# EasyEDA Pro project 调参板V2.eprj

# Schematic Schematic1
Create Date: 2024-02-26; Page Name: P1; Project Name: 调参板V2; Schematic Name: Schematic1; Update Date: 2024-02-26; Company: 嘉立创EDA; Page Size: A4; Version: V1.0
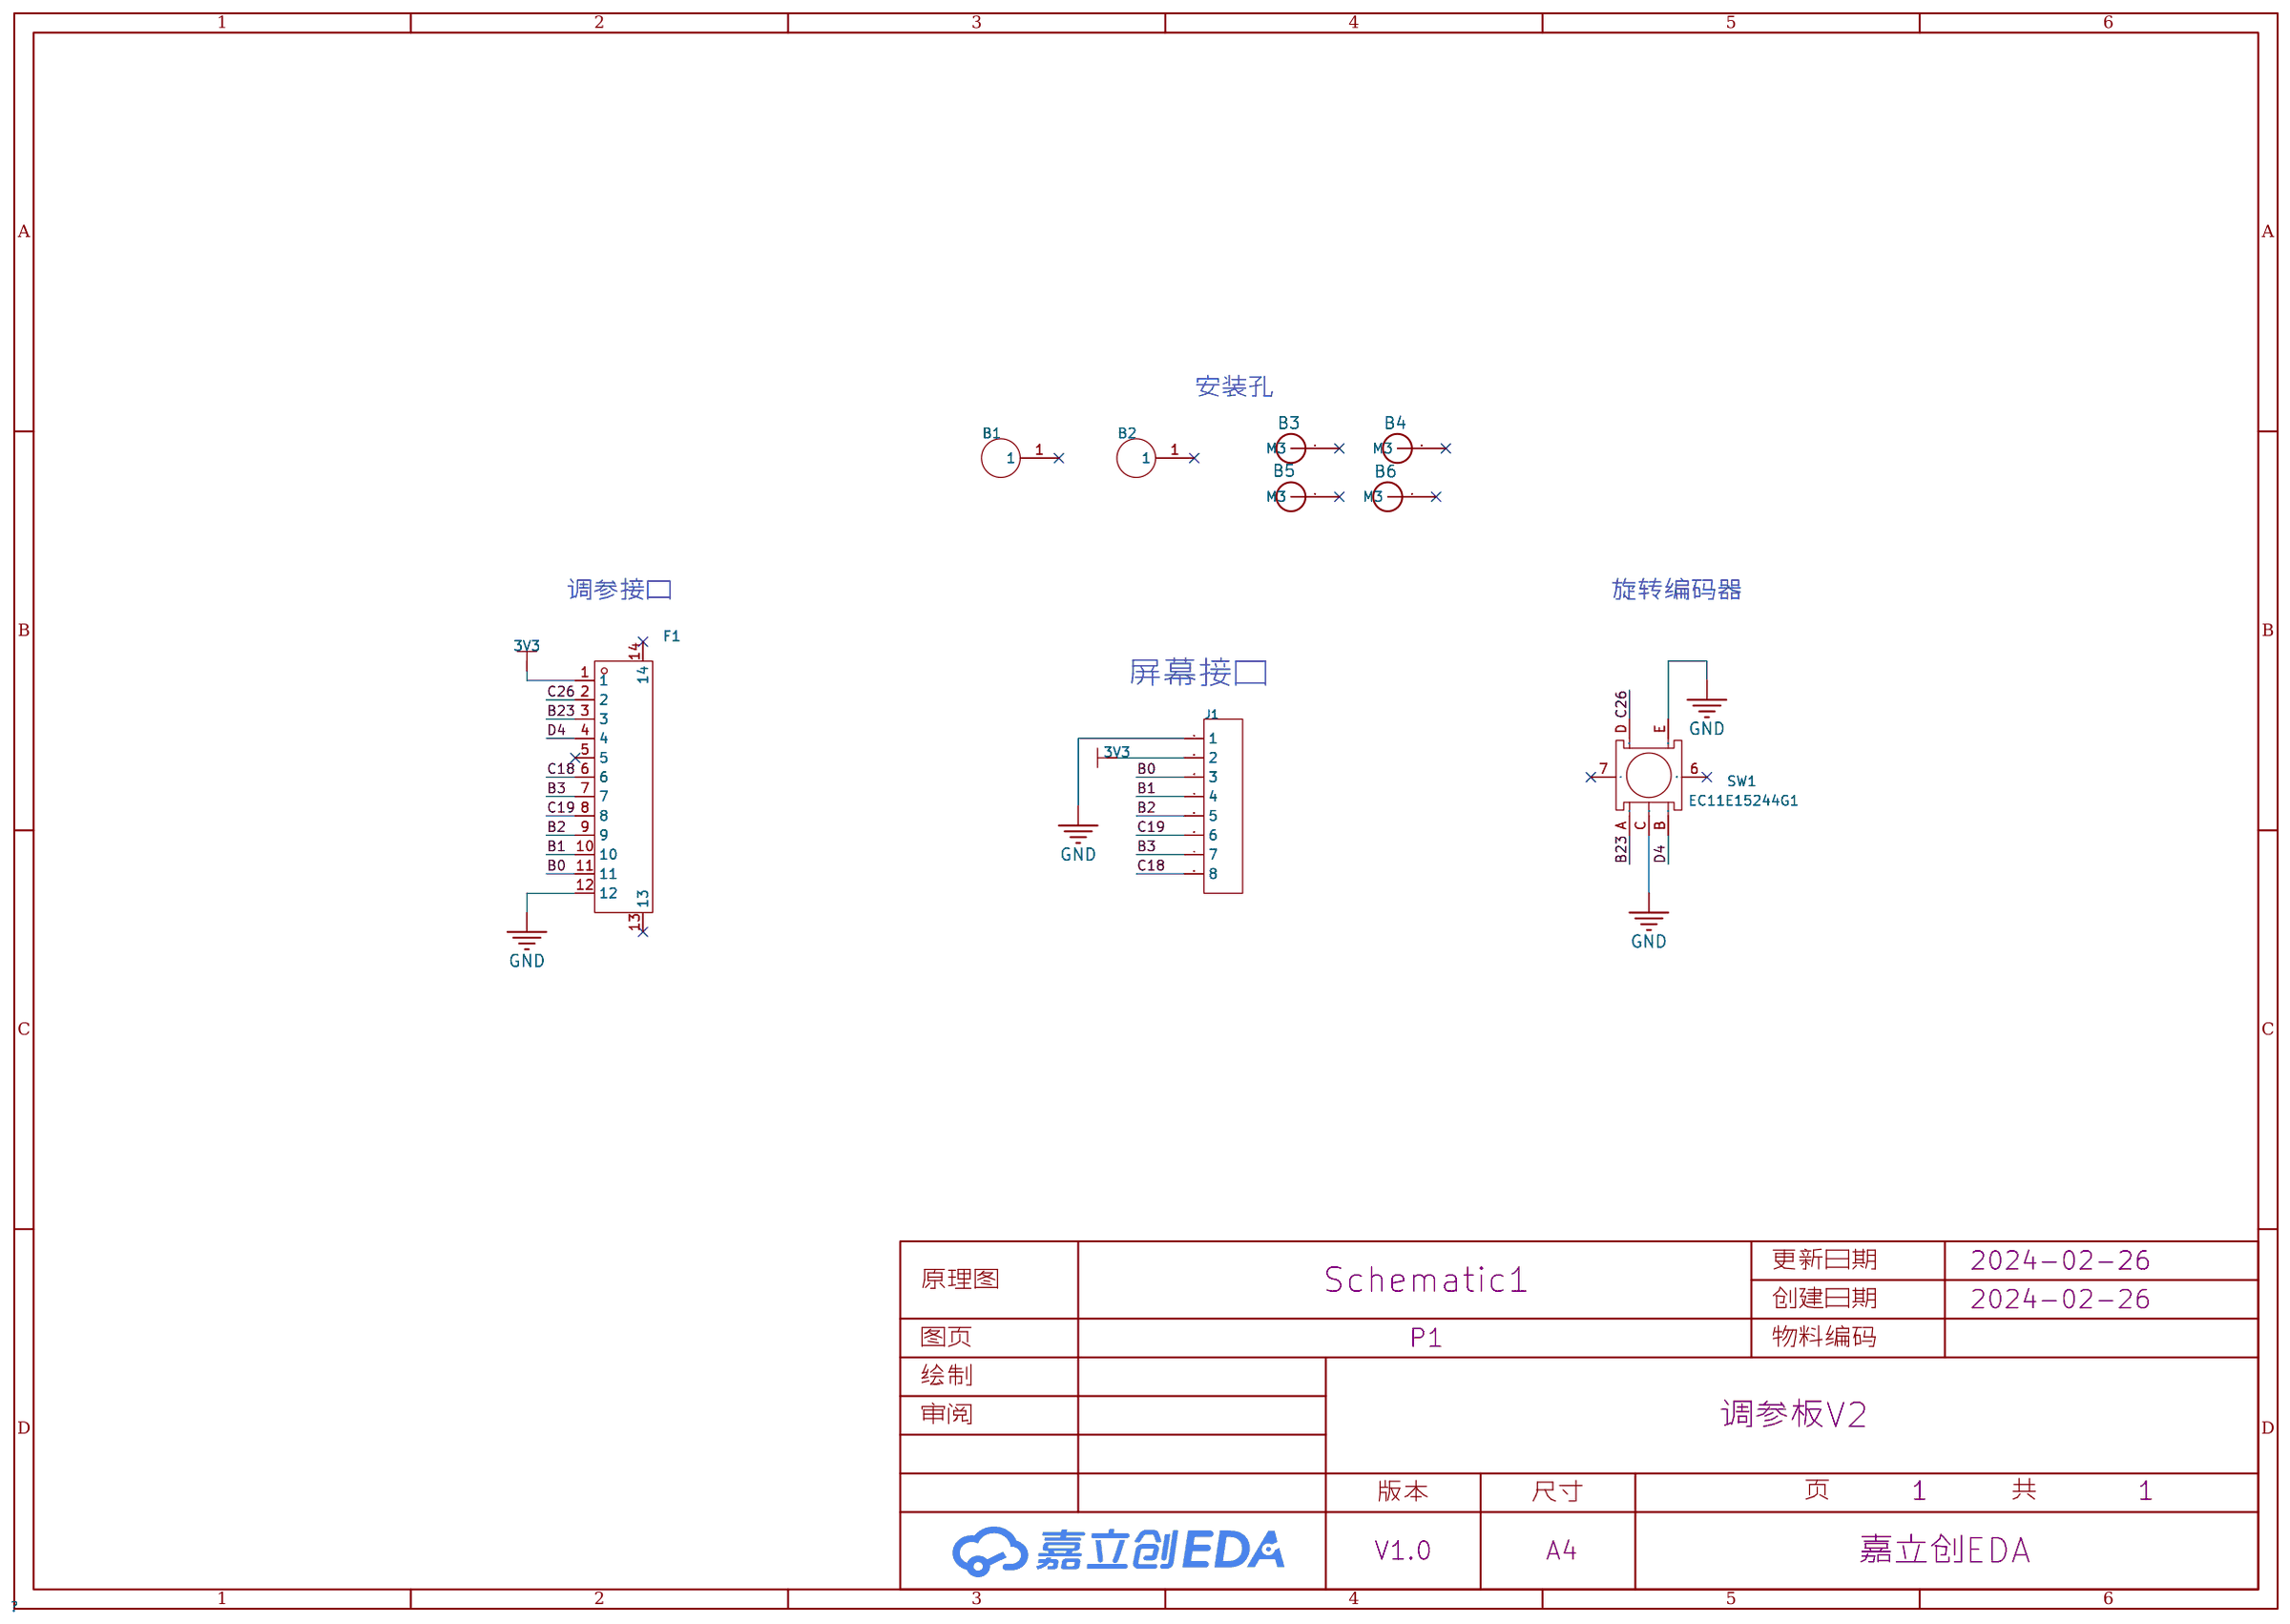
[diagram p0: schematic sheet]

## Parts
B1  -  [M2]
B2  -  [M2]
B3  M3螺柱孔_JX  [M3]
B4  M3螺柱孔_JX  [M3]
B5  M3螺柱孔_JX  [M3]
B6  M3螺柱孔_JX  [M3]
F1  FPC-1.0FX-12PWCR-H20  [FPC-SMD_XUNPU_FPC-1.0FX-12PWCR-H20]
J1  -  [HDR-TH_8P-P2.54-V-F-1]
SW1  EC11E15244G1  [SW-TH_EC11E15244G1]

## Library data of the parts
B1 B2 = M2
B3-B6 = M3螺柱孔_JX
F1 = FPC-1.0FX-12PWCR-H20: 锁定特性:翻盖式;触点类型:下接;触点数量:12P;间距:1mm;安装类型:卧贴;; LCSC Part Name: 间距:1mm P数:12P 翻盖式 下接; Supplier Part: C19269355; Manufacturer: XUNPU(讯普); Supplier Footprint: SMD,P=1mm,卧贴; Datasheet: https://atta.szlcsc.com/upload/public/pdf/source/20231121/46D1D420E162B395A0FFF09C3BB98E72.pdf; Supplier: LCSC; Locking Feature: 翻盖式; Contact Type: 下接; Number of Contacts: 12P; Pitch: 1mm; Mounting Type: 卧贴; Height Above Board: 2mm
J1 = HDR-F_2.54_1x8P: Supplier Part: C27438; Supplier Footprint: 插件
SW1 = EC11E15244G1: LCSC Part Name: 编码器; Supplier Part: C370970; Manufacturer: ALPSALPINE(阿尔卑斯阿尔派); Supplier Footprint: 插件; JLCPCB Part Class: 扩展库; Datasheet: https://atta.szlcsc.com/upload/public/pdf/source/20190222/C370970_45D3DFC793E5CF6FACAF06DB9E7FAE9E.pdf; Supplier: LCSC

## Nets
3V3: F1.1 J1.2
GND: F1.12 J1.1 SW1.C SW1.E
B0: F1.11 J1.3
B1: F1.10 J1.4
B2: F1.9 J1.5
B3: F1.7 J1.7
B23: F1.3 SW1.A
C18: F1.6 J1.8
C19: F1.8 J1.6
C26: F1.2 SW1.D
D4: F1.4 SW1.B

Not connected (* = marked no-connect by the designer): B1 1*; B2 1*; B3 1(M3)*; B4 1(M3)*; B5 1(M3)*; B6 1(M3)*; F1 5* 13* 14*; SW1 6* 7*

## Notes on the sheet
- 安装孔
- 调参接口
- 旋转编码器
- 屏幕接口

# Board PCB1
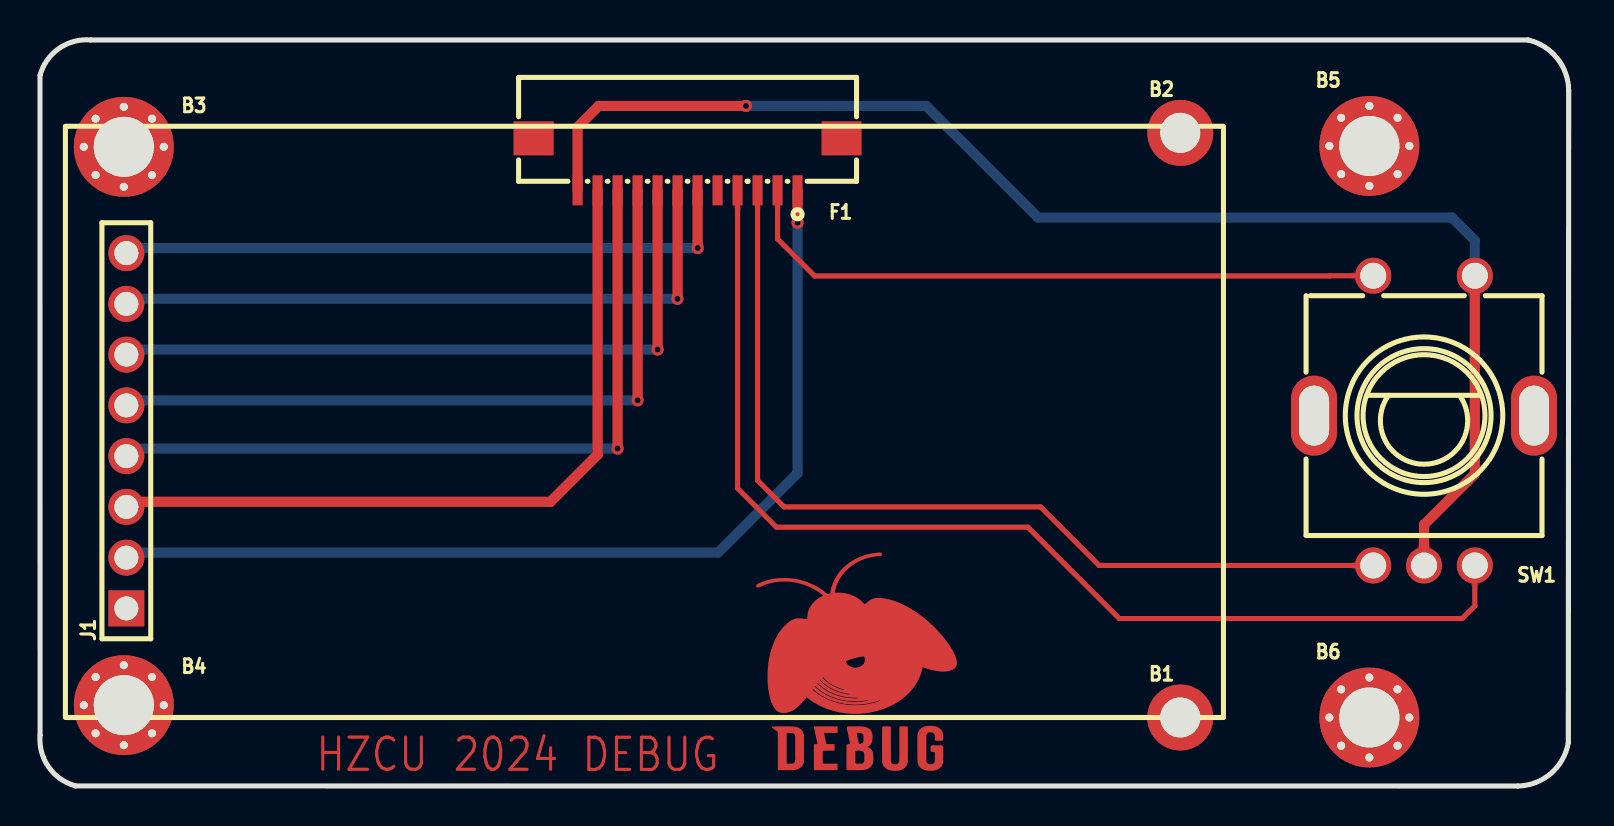
[diagram p1: board, top side]
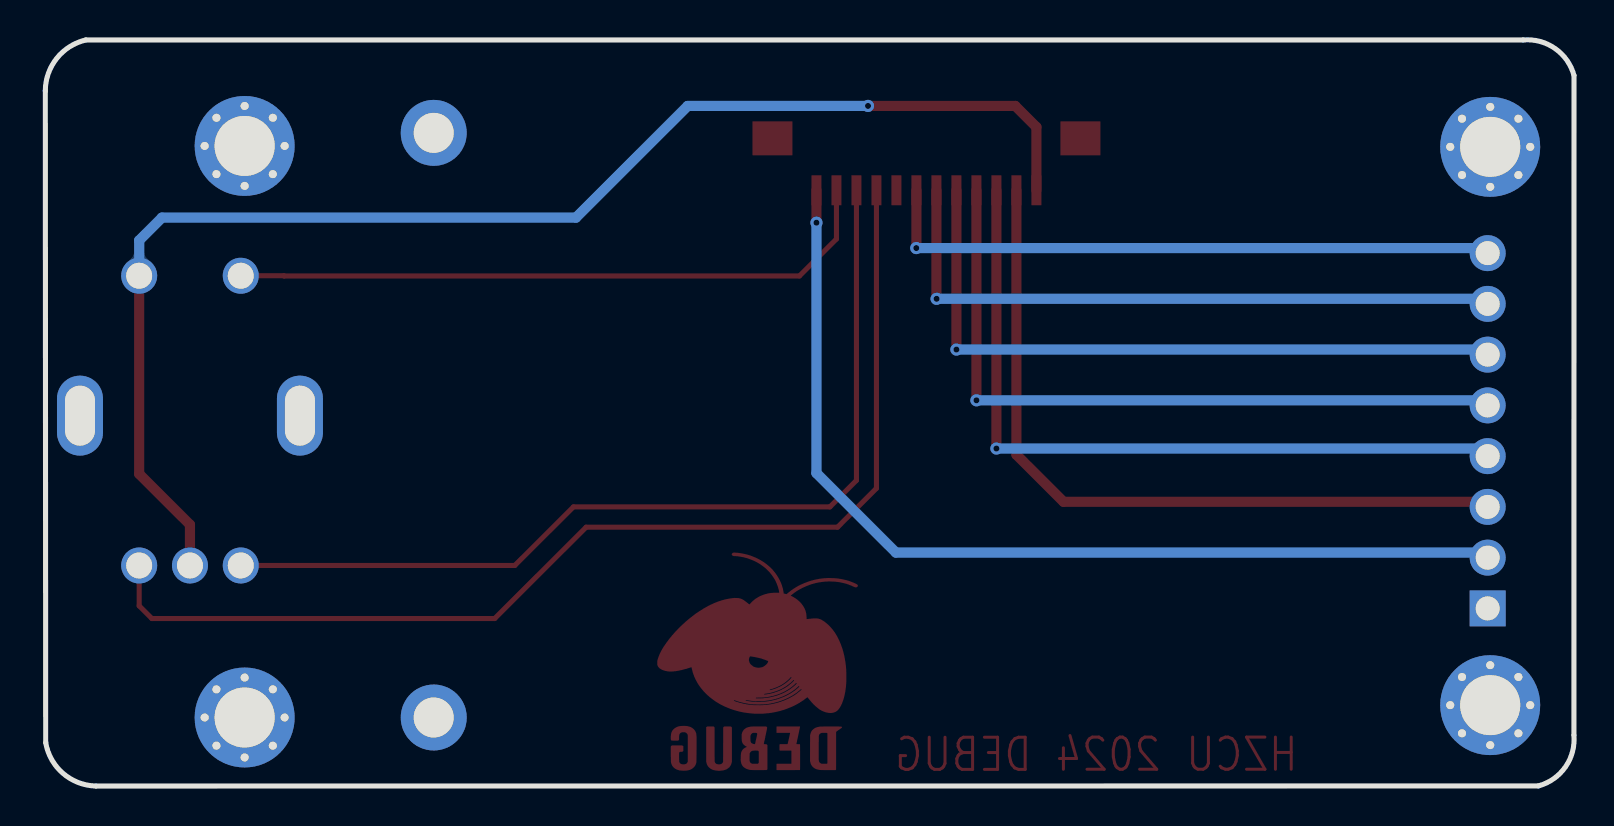
[diagram p2: board, bottom side, seen from below]

Outline 76.45 x 37.34 mm; copper layers: Top Layer, Bottom Layer. Coordinates in mm from the lower left corner of the outline.
Outline path: 0,35.56 0,2.54 arc(0.43,0.95) 1.78,0 73.91,0 arc(75.56,0.63) 76.43,2.17 76.45,34.8 arc(75.88,36.42) 74.42,37.34 2.54,37.34 arc(0.95,36.91) 0,35.56
Stack: Top Layer 0.035mm / Dielectric1 1.51mm FR4 er 4.5 / Bottom Layer 0.035mm

## Design rules (mm)
template: JLCPCB Capability(Two Layers Board)
spacing copperThickness1oz (default): track to track 0.102, other pairs 0.152 to 0.3
spacing copperThickness2oz: track to track 0.203, other pairs 0.152 to 0.3
track width copperThickness1oz (default): min 0.127, default 0.254, max 2.54
track width copperThickness2oz: min 0.203, default 0.254, max 2.54
differential pair differentialPair (default): width min 0.127, default 0.254, max 2.54; gap min 0.152, default 0.152
via viaSize (default): diameter min 0.5, default 0.61, max 10; hole min 0.3, default 0.305, max 6.3

## Placement (name value [footprint] x y rotation side)
B1  -  [M2]  57.03 3.43 0 top
B2  -  [M2]  57.03 32.69 0 top
B3  M3螺柱孔_JX  [M3]  4.19 31.99 0 top
B4  M3螺柱孔_JX  [M3]  4.19 4.05 0 top
B5  M3螺柱孔_JX  [M3]  66.48 32.03 0 top
B6  M3螺柱孔_JX  [M3]  66.48 3.43 0 top
F1  FPC-1.0FX-12PWCR-H20  [FPC-SMD_XUNPU_FPC-1.0FX-12PWCR-H20]  32.38 31.12 180 top
J1  -  [HDR-TH_8P-P2.54-V-F-1]  4.32 17.78 90 top
SW1  EC11E15244G1  [SW-TH_EC11E15244G1]  69.22 18.29 0 top

## Footprints (pads in the part's own frame, mm; a bottom-side part is the same pattern mirrored in y, then rotated)
FPC-SMD_XUNPU_FPC-1.0FX-12PWCR-H20
  rect 0.5x1.5 smd: 1(-5.5,1.3) 2(-4.5,1.3) 3(-3.5,1.3) 4(-2.5,1.3) 5(-1.5,1.3) 6(-0.5,1.3) 7(0.5,1.3) 8(1.5,1.3) 9(2.5,1.3) 10(3.5,1.3) 11(4.5,1.3) 12(5.5,1.3)
  rect 2x1.7 smd: 13(7.7,-1.3) 14(-7.7,-1.3)
HDR-TH_8P-P2.54-V-F-1
  rect 1.8x1.8 hole 1.2: 1(-8.89,0)
  round 1.8 hole 1.2: 2(-6.35,0) 3(-3.81,0) 4(-1.27,0) 5(1.27,0) 6(3.81,0) 7(6.35,0) 8(8.89,0)
M2
  round 3.3 hole 2: 1(0,0)
M3
  round 0.6 hole 0.405x0.4: 1(-2,0) 1(-1.41,1.409) 1(-1.41,-1.41) 1(0,2) 1(0,-2) 1(1.41,1.409) 1(1.41,-1.41) 1(2,0)
  round 5 hole 3.005x3: 1(0,0)
SW-TH_EC11E15244G1
  oval 2.3x4 hole 1.5x3: 6(5.5,0.25) 7(-5.5,0.25)
  round 1.8 hole 1.3: A(-2.54,-7.25) B(2.54,-7.25) C(0,-7.25) D(-2.54,7.25) E(2.54,7.25)

## Nets
As in the schematic.

Pads without a net: B1 1; B2 1; B3 1; B4 1; B5 1; B6 1; F1 5 13 14; SW1 6 7

## Via types
v1: diameter 0.61, hole 0.305, Top Layer to Bottom Layer, 7 vias

## Routing (per net, layer and track width the routed paths; a pad name or vN(x,y) marks a point on that pad's centre or on a via; arc(x,y) is an arc through that point)
3V3: length 49.5
  Top Layer w0.508: F1.1 v1(37.88,28.19)
  Bottom Layer w0.508: v1(37.88,28.19) 37.88,15.66 33.91,11.68 4.19,11.68
GND: length 68.6
  Top Layer w0.508: v1(35.31,34.04) 27.94,34.04 26.88,32.98 F1.12 ; SW1.C 69.22,13.08 71.75,15.62 SW1.E
  Bottom Layer w0.508: SW1.E 71.75,27.31 70.61,28.45 49.91,28.45 44.32,34.04 v1(35.31,34.04)
B0: length 37.9
  Top Layer w0.508: 4.19,14.22 25.53,14.22 27.88,16.58 F1.11
B1: length 37.7
  Top Layer w0.508: F1.10 v1(28.88,16.89)
  Bottom Layer w0.508: 4.19,16.76 4.32,16.89 v1(28.88,16.89)
B2: length 36.2
  Top Layer w0.508: F1.9 v1(29.88,19.3)
  Bottom Layer w0.508: v1(29.88,19.3) 4.19,19.3
B3: length 33.1
  Top Layer w0.508: v1(31.88,24.38) 31.88,24.39 F1.7
  Bottom Layer w0.508: v1(31.88,24.38) 4.19,24.38
B23: length 47.1
  Top Layer w0.254: SW1.A 52.97,11.04 50.04,13.97 37.21,13.97 35.88,15.3 F1.3
C18: length 31.6
  Top Layer w0.508: F1.6 32.88,26.93 v1(32.89,26.92)
  Bottom Layer w0.508: v1(32.89,26.92) 4.19,26.92
C19: length 34.7
  Top Layer w0.508: F1.8 v1(30.88,21.84)
  Bottom Layer w0.508: v1(30.88,21.84) 4.19,21.84
C26: length 33
  Top Layer w0.254: SW1.D 64.52,25.54 64.5,25.53 38.73,25.53 36.88,27.38 F1.2
D4: length 56.8
  Top Layer w0.254: SW1.B 71.75,9.02 71.12,8.38 53.97,8.38 49.4,12.95 36.83,12.95 34.88,14.9 F1.4

## Copper pours and planes (outline as drawn; the poured copper is in the pictures)
GND on Top Layer: -4.45,41.02 82.04,41.02 82.04,-4.7 -4.32,-4.7 -4.45,-4.57
GND on Top Layer: -4.06,40.77 80.9,40.77 81.03,40.89 81.03,-5.46 -3.94,-5.46 -4.06,-5.33
GND on Bottom Layer: -4.19,40.89 81.03,40.89 81.03,-5.59 -4.45,-5.59 -4.45,40.64

Small or netless copper shapes (teardrops, artwork), in the pictures only: 14 on Top Layer, 1 on Bottom Layer

## Text on the board
Top Layer: HZCU | 2024 | DEBUG
Top Solder Mask Layer: HZCU | 2024 | DEBUG
